# Altium schematic sheet SPEC-A7-TOP.SchDoc: SPEC-A7
size 420 x 297 mm; Author: G.Kasprowicz; CompanyName: WUT ISE; DrawnBy: G.Kasprowicz; Organization: WUT ISE; Address1: PW ISE; Address2: Nowowiejska 15/19 00-665 Warsaw; Address3: gkasprow@gmail.com; Revision: 2; SheetNumber: 1; SheetTotal: 18; ModifiedBy: -; CheckedDate: -; Title2: TOP; DivGrp: WUT ISE; Designer: G.Kasprowicz; ModifiedDate: -; ProjectName: Sensor Box
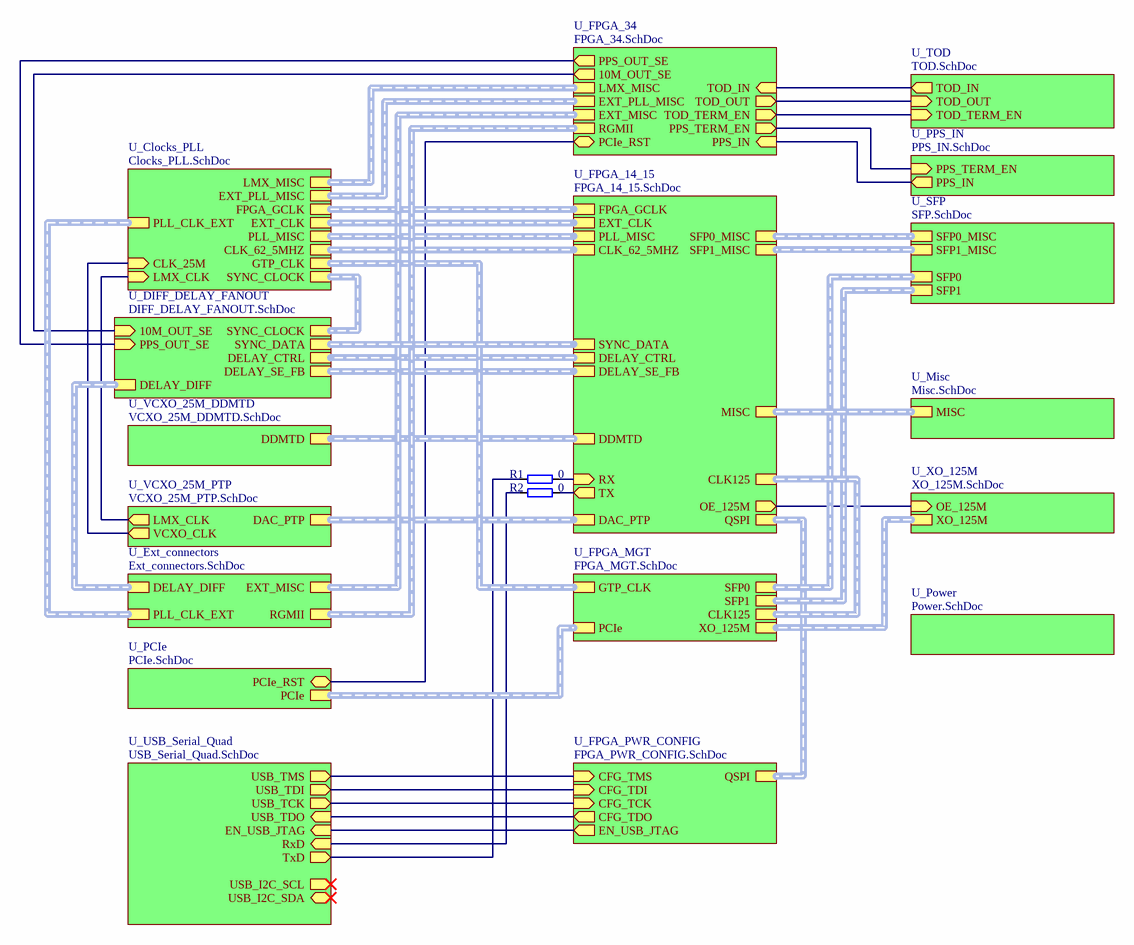
[diagram p0: SPEC-A7-TOP.SchDoc]

## Parts
R1  0  [RESC1005X40N]
R2  0  [RESC1005X40N]

## Sub-sheets
U_Clocks_PLL = Clocks_PLL.SchDoc: CLK_25M (in), PLL_MISC (harness PLL_MISC), LMX_CLK (in), LMX_MISC (harness LMX_MISC), EXT_PLL_MISC (harness PLL_MISC), CLK_62_5MHZ (harness CLK), EXT_CLK (harness CLK), PLL_CLK_EXT (harness PLL_CLK), FPGA_GCLK (harness CLK), SYNC_CLOCK (harness DFF), GTP_CLK (harness CLK)
U_DIFF_DELAY_FANOUT = DIFF_DELAY_FANOUT.SchDoc: SYNC_DATA (harness DFF), DELAY_DIFF (harness DELAY_DIFF), DELAY_CTRL (harness DELAY_CTRL), DELAY_SE_FB (harness DELAY_SE_FB), 10M_OUT_SE (in), PPS_OUT_SE (in), SYNC_CLOCK
U_Ext_connectors = Ext_connectors.SchDoc: RGMII (harness RGMII), EXT_MISC (harness EXT_CON_MISC), PLL_CLK_EXT (harness PLL_CLK), DELAY_DIFF (harness DELAY_DIFF)
U_FPGA_14_15 = FPGA_14_15.SchDoc: DDMTD (harness DDMTD), DAC_PTP (harness DAC_PTP), PLL_MISC (harness PLL_MISC), DELAY_CTRL (harness DELAY_CTRL), SYNC_DATA (harness SYNC_DATA), DELAY_SE_FB (harness DELAY_SE_FB), SFP0_MISC (harness SFP_MISC), SFP1_MISC (harness SFP_MISC), MISC (harness MISC), QSPI (harness QSPI), OE_125M (out), RX (in), TX (out), CLK_62_5MHZ (harness CLK), EXT_CLK (harness CLK), FPGA_GCLK (harness CLK), CLK125 (harness CLK)
U_FPGA_34 = FPGA_34.SchDoc: EXT_PLL_MISC (harness PLL_MISC), LMX_MISC (harness LMX_MISC), PCIe_RST (bidir), EXT_MISC (harness EXT_CON_MISC), RGMII (harness RGMII), TOD_IN (in), TOD_OUT (out), TOD_TERM_EN (out), PPS_TERM_EN (out), PPS_IN (in), PPS_OUT_SE (out), 10M_OUT_SE (out)
U_FPGA_MGT = FPGA_MGT.SchDoc: XO_125M (harness XO_125M), SFP0 (harness SFP), SFP1 (harness SFP), PCIe (harness PCIe), GTP_CLK (harness CLK), CLK125 (harness CLK)
U_FPGA_PWR_CONFIG = FPGA_PWR_CONFIG.SchDoc: CFG_TMS (in), CFG_TCK (in), CFG_TDO (out), CFG_TDI (in), EN_USB_JTAG (out), QSPI (harness QSPI)
U_Misc = Misc.SchDoc: MISC (harness MISC)
U_PCIe = PCIe.SchDoc: PCIe_RST (bidir), PCIe (harness PCIe)
U_Power = Power.SchDoc: no entries
U_PPS_IN = PPS_IN.SchDoc: PPS_TERM_EN (in), PPS_IN (out)
U_SFP = SFP.SchDoc: SFP0_MISC (harness SFP_MISC), SFP1_MISC (harness SFP_MISC), SFP0 (harness SFP), SFP1 (harness SFP)
U_TOD = TOD.SchDoc: TOD_TERM_EN (in), TOD_IN (out), TOD_OUT (in)
U_USB_Serial_Quad = USB_Serial_Quad.SchDoc: USB_TDO (in), RxD (in), USB_TMS (out), USB_TDI (out), USB_TCK (out), TxD (out), EN_USB_JTAG (in), USB_I2C_SDA (bidir), USB_I2C_SCL (out)
U_VCXO_25M_DDMTD = VCXO_25M_DDMTD.SchDoc: DDMTD (harness DDMTD)
U_VCXO_25M_PTP = VCXO_25M_PTP.SchDoc: DAC_PTP (harness DAC_PTP), VCXO_CLK (out), LMX_CLK (out)
U_XO_125M = XO_125M.SchDoc: XO_125M (harness XO_125M), OE_125M (in)

## Nets
NetR1_1: R1.1 ; sheet U_USB_Serial_Quad/TxD
NetR1_2: R1.2 ; sheet U_FPGA_14_15/RX
NetR2_1: R2.1 ; sheet U_USB_Serial_Quad/RxD
NetR2_2: R2.2 ; sheet U_FPGA_14_15/TX
(unnamed): sheet U_Clocks_PLL/CLK_25M, sheet U_VCXO_25M_PTP/VCXO_CLK
(unnamed): sheet U_Clocks_PLL/LMX_CLK, sheet U_VCXO_25M_PTP/LMX_CLK
(unnamed): sheet U_FPGA_14_15/OE_125M, sheet U_XO_125M/OE_125M
(unnamed): sheet U_DIFF_DELAY_FANOUT/10M_OUT_SE, sheet U_FPGA_34/10M_OUT_SE
(unnamed): sheet U_DIFF_DELAY_FANOUT/PPS_OUT_SE, sheet U_FPGA_34/PPS_OUT_SE
(unnamed): sheet U_FPGA_34/PCIe_RST, sheet U_PCIe/PCIe_RST
(unnamed): sheet U_FPGA_34/TOD_IN, sheet U_TOD/TOD_IN
(unnamed): sheet U_FPGA_34/TOD_OUT, sheet U_TOD/TOD_OUT
(unnamed): sheet U_FPGA_34/TOD_TERM_EN, sheet U_TOD/TOD_TERM_EN
(unnamed): sheet U_FPGA_34/PPS_TERM_EN, sheet U_PPS_IN/PPS_TERM_EN
(unnamed): sheet U_FPGA_34/PPS_IN, sheet U_PPS_IN/PPS_IN
(unnamed): sheet U_USB_Serial_Quad/USB_TDO, sheet U_FPGA_PWR_CONFIG/CFG_TDO
(unnamed): sheet U_USB_Serial_Quad/USB_TMS, sheet U_FPGA_PWR_CONFIG/CFG_TMS
(unnamed): sheet U_USB_Serial_Quad/USB_TDI, sheet U_FPGA_PWR_CONFIG/CFG_TDI
(unnamed): sheet U_USB_Serial_Quad/USB_TCK, sheet U_FPGA_PWR_CONFIG/CFG_TCK
(unnamed): sheet U_USB_Serial_Quad/EN_USB_JTAG, sheet U_FPGA_PWR_CONFIG/EN_USB_JTAG

## Buses and harness runs
harness sheet U_Clocks_PLL/CLK_62_5MHZ = sheet U_FPGA_14_15/CLK_62_5MHZ
harness sheet U_Clocks_PLL/EXT_CLK = sheet U_FPGA_14_15/EXT_CLK
harness sheet U_Clocks_PLL/EXT_PLL_MISC = sheet U_FPGA_34/EXT_PLL_MISC
harness sheet U_Clocks_PLL/FPGA_GCLK = sheet U_FPGA_14_15/FPGA_GCLK
harness sheet U_Clocks_PLL/GTP_CLK = sheet U_FPGA_MGT/GTP_CLK
harness sheet U_Clocks_PLL/LMX_MISC = sheet U_FPGA_34/LMX_MISC
harness sheet U_Clocks_PLL/PLL_CLK_EXT = sheet U_Ext_connectors/PLL_CLK_EXT
harness sheet U_Clocks_PLL/PLL_MISC = sheet U_FPGA_14_15/PLL_MISC
harness sheet U_Clocks_PLL/SYNC_CLOCK = sheet U_DIFF_DELAY_FANOUT/SYNC_CLOCK
harness sheet U_DIFF_DELAY_FANOUT/DELAY_CTRL = sheet U_FPGA_14_15/DELAY_CTRL
harness sheet U_DIFF_DELAY_FANOUT/DELAY_DIFF = sheet U_Ext_connectors/DELAY_DIFF
harness sheet U_DIFF_DELAY_FANOUT/DELAY_SE_FB = sheet U_FPGA_14_15/DELAY_SE_FB
harness sheet U_DIFF_DELAY_FANOUT/SYNC_DATA = sheet U_FPGA_14_15/SYNC_DATA
harness sheet U_Ext_connectors/EXT_MISC = sheet U_FPGA_34/EXT_MISC
harness sheet U_Ext_connectors/RGMII = sheet U_FPGA_34/RGMII
harness sheet U_FPGA_14_15/CLK125 = sheet U_FPGA_MGT/CLK125
harness sheet U_FPGA_14_15/DAC_PTP = sheet U_VCXO_25M_PTP/DAC_PTP
harness sheet U_FPGA_14_15/DDMTD = sheet U_VCXO_25M_DDMTD/DDMTD
harness sheet U_FPGA_14_15/MISC = sheet U_Misc/MISC
harness sheet U_FPGA_14_15/QSPI = sheet U_FPGA_PWR_CONFIG/QSPI
harness sheet U_FPGA_14_15/SFP0_MISC = sheet U_SFP/SFP0_MISC
harness sheet U_FPGA_14_15/SFP1_MISC = sheet U_SFP/SFP1_MISC
harness sheet U_FPGA_MGT/PCIe = sheet U_PCIe/PCIe
harness sheet U_FPGA_MGT/SFP0 = sheet U_SFP/SFP0
harness sheet U_FPGA_MGT/SFP1 = sheet U_SFP/SFP1
harness sheet U_FPGA_MGT/XO_125M = sheet U_XO_125M/XO_125M

## Notes on the sheet
- Project/Equipment
- Document
- Designer
- Drawn by
- Check.by
- Copyright WUT ISE 2024.
  This documentation describes Open Hardware and is licensed under the CERN OHL v.2. You may redistribute and modify this documentation under the terms of the CERN OHL v.2. (http://ohwr.org/CERNOHL). This documentation is distributed WITHOUT ANY EXPRESS OR IMPLIED WARRANTY, INCLUDING OF MERCHANTABILITY, SATISFACTORY QUALITY AND FITNESS FOR A PARTICULAR PURPOSE. Please see the CERN OHL v.2 for applicable conditions.
- Contact
- File
- Last Mod.
- Print Date
- Sheet
- Size
- A3
- of
- Rev

## Library data of the parts
R1 R2 = R0402_0R_JUMPER: Resistor; Part Description: 1A (0.05R Max DC Resistance) Zero Ohm Jumper; Manufacturer: GENERIC; Manufacturer1 Part Number: 232270591001L; PressFit: No; Part Number: R0402_0R_JUMPER; Component Kind: Standard; Component Type: Standard; Pin Count: 2; Value: 0; Status: Not Recommended; Manufacturer Part Number: R0402_0R_JUMPER; Case: 0402; Mounted: Yes; Sense: No; Socket: No; SMD: Yes; Manufacturer1 Example: YAGEO PHYCOMP; Manufacturer1 ComponentHeight: 0.4mm; HelpURL: \\cern.ch\dfs\Applications\Altium\Datasheets\R0402_Phycomp_RC0402.pdf; Author: CERN DEM JLC; CreateDate: 03.12.2007; LatestRevisionDate: 17.10.2012